# EAGLE design RFM96H (EAGLE 9.6.2)
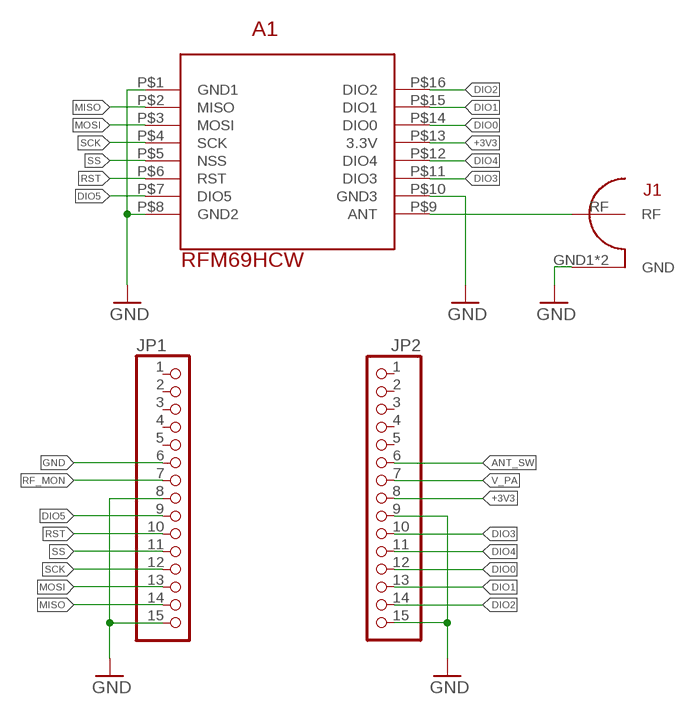
[diagram p0: schematic, sheet 1]

## Parts
A1  RFM69HCW  [RFM69HCW]
J1  CON-SMA-EDGE-S  [CON-SMA-EDGE-S]
JP1  PINHD-1X15  [1X15]
JP2  PINHD-1X15  [1X15]

## Nets
+3V3: A1.P$13(3.3V) JP2.8
ANT_SW: JP2.6
DIO0: A1.P$14(DIO0) JP2.12
DIO1: A1.P$15(DIO1) JP2.13
DIO2: A1.P$16(DIO2) JP2.14
DIO3: A1.P$11(DIO3) JP2.10
DIO4: A1.P$12(DIO4) JP2.11
DIO5: A1.P$7(DIO5) JP1.9
GND: A1.P$1(GND1) A1.P$8(GND2) A1.P$10(GND3) J1.GND1(GND) J1.GND2(GND) JP1.6 JP1.8 JP1.15 JP2.9 JP2.15
MISO: A1.P$2(MISO) JP1.14
MOSI: A1.P$3(MOSI) JP1.13
N$22 [RF]: A1.P$9(ANT) J1.RF
RF_MON: JP1.7
RST: A1.P$6(RST) JP1.10
SCK: A1.P$4(SCK) JP1.12
SS: A1.P$5(NSS) JP1.11
V_PA: JP2.7
Unconnected: JP1.1 JP1.2 JP1.3 JP1.4 JP1.5 JP2.1 JP2.2 JP2.3 JP2.4 JP2.5

## Library data of the parts
A1 = ruark2:RFM69HCW: RFM69HCW WIRELESS TRANSCEIVER 91; PARTNO: 1568-1394-ND
J1 = ruark2:CON-SMA-EDGE-S: SMA Connector Jack, Female Socket Board Edge, End Launch Solder; PARTNO: CON-SMA-EDGE-S-ND
JP1 JP2 = pinhead:PINHD-1X15: PIN HEADER

## Net classes
1 RF: clearance 0.127 mm

## Board
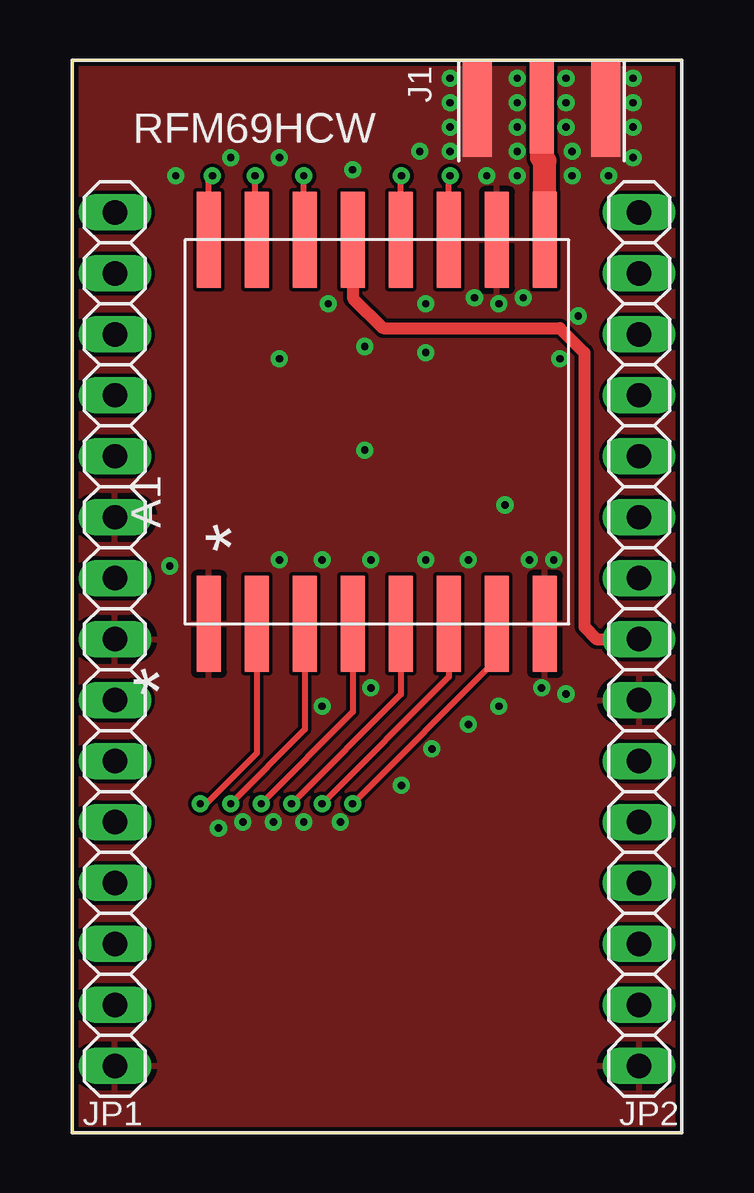
[diagram p1: board, top side]
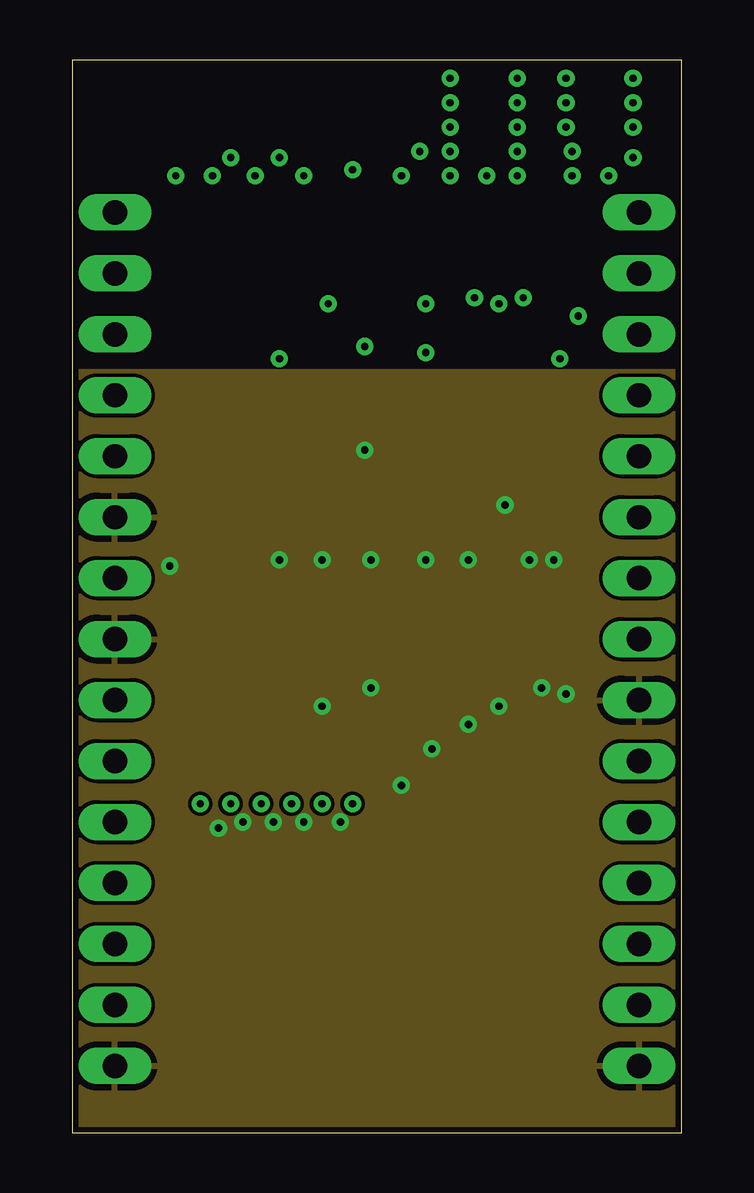
[diagram p2: board, inner layer Route2]
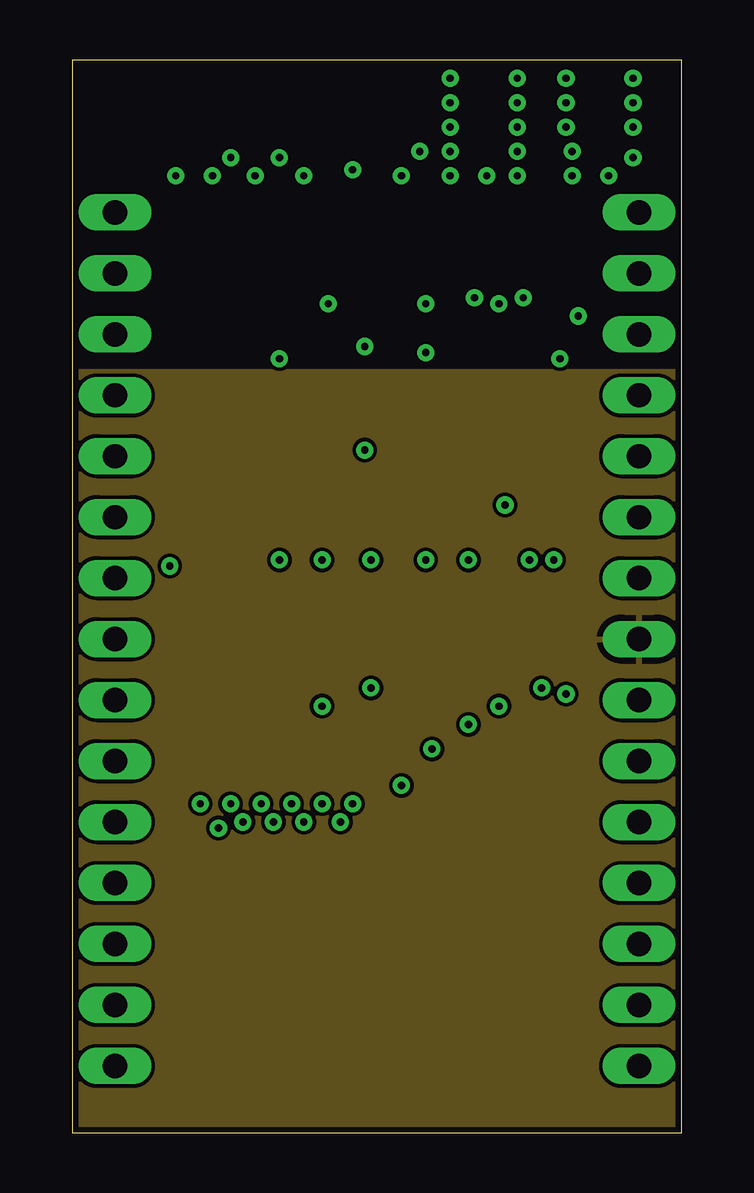
[diagram p3: board, inner layer Route15]
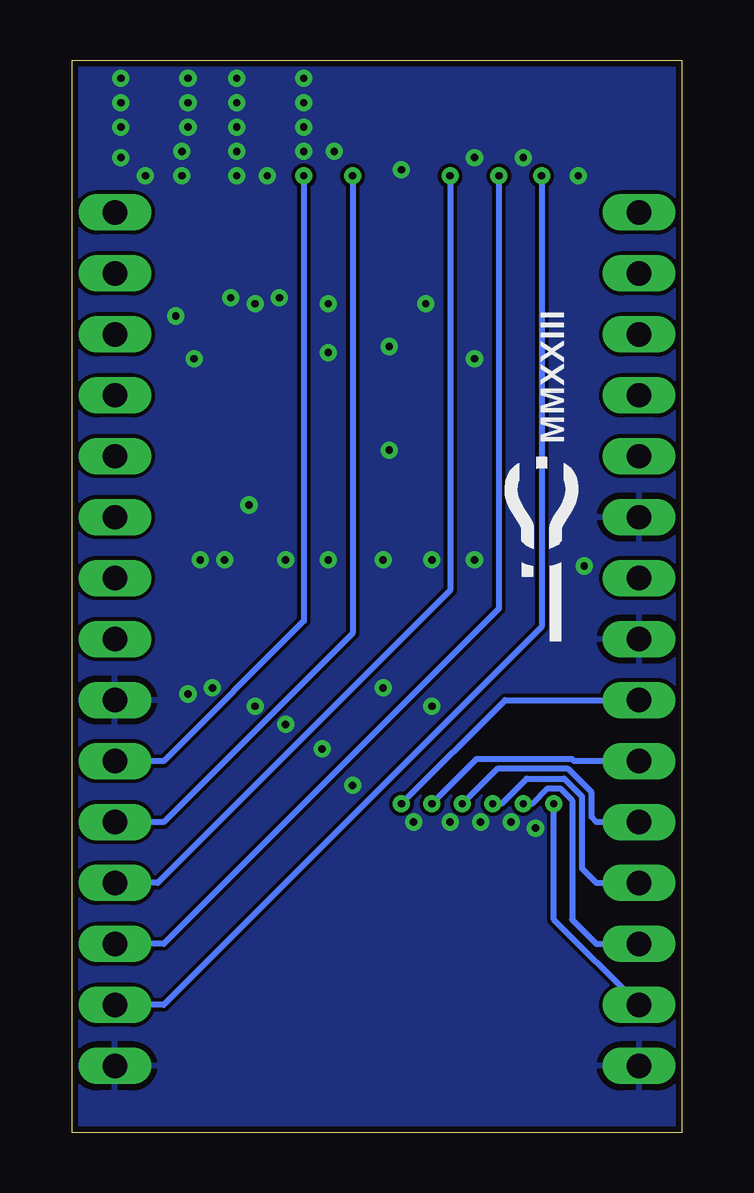
[diagram p4: board, bottom side, seen from below]

Size 25.4 x 44.7 mm. Coordinates in mm from the lower left corner, seen from the top.
Outline: 0,0 25.4,0 25.4,44.7 0,44.7 0,0
Copper layers (1+2*15+16): Top 0.035mm / dielectric 1.5mm / Route2 0.035mm / dielectric 0.15mm / Route15 0.035mm / dielectric 0.2mm / Bottom 0.035mm
Design rules "default *": minimum track width 6mil, minimum drill 12mil, track to track 6mil, track to pad 6mil, pad to pad 6mil, via to via 6mil, smd to smd 6mil, copper to edge 10mil, drill to drill 6mil, minimum pad ring 10mil, minimum via ring 8mil, stop-mask expansion 4mil, vias tented up to drill 12mil, thermal gap 10mil

### Footprints (pad centres in the part's own frame; a part is rotated, then mirrored left to right if it is on the bottom)
RFM69HCW = smd 4 x 1: P$1 -8,7; P$2 -8,5; P$3 -8,3; P$4 -8,1; P$5 -8,-1; P$6 -8,-3; P$7 -8,-5; P$8 -8,-7; P$9 8,-7; P$10 8,-5; P$11 8,-3; P$12 8,-1; P$13 8,1; P$14 8,3; P$15 8,5; P$16 8,7
CON-SMA-EDGE-S = smd 1.2 x 4: GND1 -2.675,0; GND2 2.675,0 | smd 1 x 3.85: RF 0,0.075
1X15 = drill 1.016 long: 1 -17.78,0; 2 -15.24,0; 3 -12.7,0; 4 -10.16,0; 5 -7.62,0; 6 -5.08,0; 7 -2.54,0; 8 0,0; 9 2.54,0; 10 5.08,0; 11 7.62,0; 12 10.16,0; 13 12.7,0; 14 15.24,0; 15 17.78,0

### Placement (x,y rotation side)
A1  12.7,29.21 90 top
J1  19.56,42.67 0 top
JP1  1.78,20.57 270 top
JP2  23.62,20.57 270 top

### Tracks (layer width: path | path; a pad name or v marks a point on that pad's centre or on a via)
+3V3
  Top 0.508: A1.P$13 11.7,34.78 12.95,33.53 20.32,33.53 21.34,32.51 21.34,21.08 21.84,20.57 JP2.8
  pour Route15: 0,0 25.4,0 25.4,31.75 0,31.75
DIO0  (via drill 0.3)
  Top 0.254: A1.P$14 9.65,37.26 v9.65,39.88
  Bottom 0.254: v9.65,39.88 9.65,22.61 21.84,10.41 JP2.12
DIO1  (via drill 0.3)
  Top 0.254: A1.P$15 7.62,37.29 v7.62,39.88
  Bottom 0.254: v7.62,39.88 7.62,21.84 21.59,7.87 JP2.13
DIO2  (via drill 0.3)
  Top 0.254: A1.P$16 5.7,39.74 v5.84,39.88
  Bottom 0.254: v5.84,39.88 5.84,21.08 21.59,5.33 JP2.14
DIO3  (via drill 0.3)
  Top 0.254: A1.P$11 15.7,39.58 15.75,39.62 v15.75,39.88
  Bottom 0.254: v15.75,39.88 15.75,21.34 21.59,15.49 JP2.10
DIO4  (via drill 0.3)
  Top 0.254: A1.P$12 13.7,39.86 v13.72,39.88
  Bottom 0.254: v13.72,39.88 13.72,20.83 21.59,12.95 JP2.11
DIO5  (via drill 0.3)
  Top 0.254: A1.P$7 17.7,19.73 v11.68,13.72
  Bottom 0.254: v11.68,13.72 7.37,18.03 JP1.9
GND  (via drill 0.3)
  other vias: 18.54,39.88 18.54,40.89 18.54,41.91 18.54,42.93 18.54,43.94 20.57,43.94 20.57,42.93 20.57,41.91 20.83,40.89 20.83,39.88 23.37,43.94 23.37,42.93 23.37,41.91 23.37,40.64 22.35,39.88 15.75,43.94 15.75,42.93 15.75,41.91 15.75,40.89 17.27,39.88 16.76,34.8 18.8,34.8 17.78,34.54 4.32,39.88 6.6,40.64 8.64,40.64 11.68,40.13 14.48,40.89 8.64,32.26 12.19,28.45 18.03,26.16 20.57,18.29 19.05,23.88 20.07,23.88 19.56,18.54 17.78,17.78 16.51,17.02 14.99,16 13.72,14.48 12.45,18.54 10.41,17.78 11.18,12.95 9.65,12.95 8.38,12.95 7.11,12.95 6.1,12.7 8.64,23.88 10.41,23.88 12.45,23.88 14.73,23.88 16.51,23.88 4.06,23.62 10.67,34.54 14.73,34.54 14.73,32.51 12.19,32.77 20.32,32.26 21.08,34.04
  pour Route2: 0,0 25.4,0 25.4,31.75 0,31.75
  pour Bottom: 0,0 25.4,0 25.4,44.7 0,44.7
  pour Top: 0,0 25.4,0 25.4,44.7 0,44.7
  pour Top (no thermals): 15.75,44.7 23.62,44.7 23.62,40.13 15.75,40.13
MISO  (via drill 0.3)
  Top 0.254: A1.P$2 7.7,15.83 5.59,13.72 v5.33,13.72
  Bottom 0.254: JP1.14 5.33,8.89 v5.33,13.72
MOSI  (via drill 0.3)
  Top 0.254: A1.P$3 9.7,16.81 v6.6,13.72
  Bottom 0.254: v6.6,13.72 6.23,13.72 5.6,14.35 5.07,14.35 4.57,13.85 4.57,8.89 3.56,7.87 JP1.13
N$22
  Top 0.965: A1.P$9 19.7,40.5 19.56,40.64 J1.RF
RST  (via drill 0.3)
  Top 0.254: A1.P$6 15.7,19 v10.41,13.72
  Bottom 0.254: JP1.10 4.49,15.49 4.57,15.57 8.56,15.57 v10.41,13.72
SCK  (via drill 0.3)
  Top 0.254: A1.P$4 11.7,17.54 v7.87,13.72
  Bottom 0.254: v7.87,13.72 7.5,13.72 6.46,14.76 4.9,14.76 4.17,14.02 4.17,11.02 3.56,10.41 JP1.12
SS  (via drill 0.3)
  Top 0.254: A1.P$5 13.7,18.27 v9.14,13.72
  Bottom 0.254: JP1.11 3.56,12.95 3.76,13.16 3.76,14.19 4.73,15.16 7.7,15.16 v9.14,13.72

### Text on the board
bPlace: MMXXIII
bStop: 029